# EAGLE design uv_exposure (EAGLE 7.2.0)
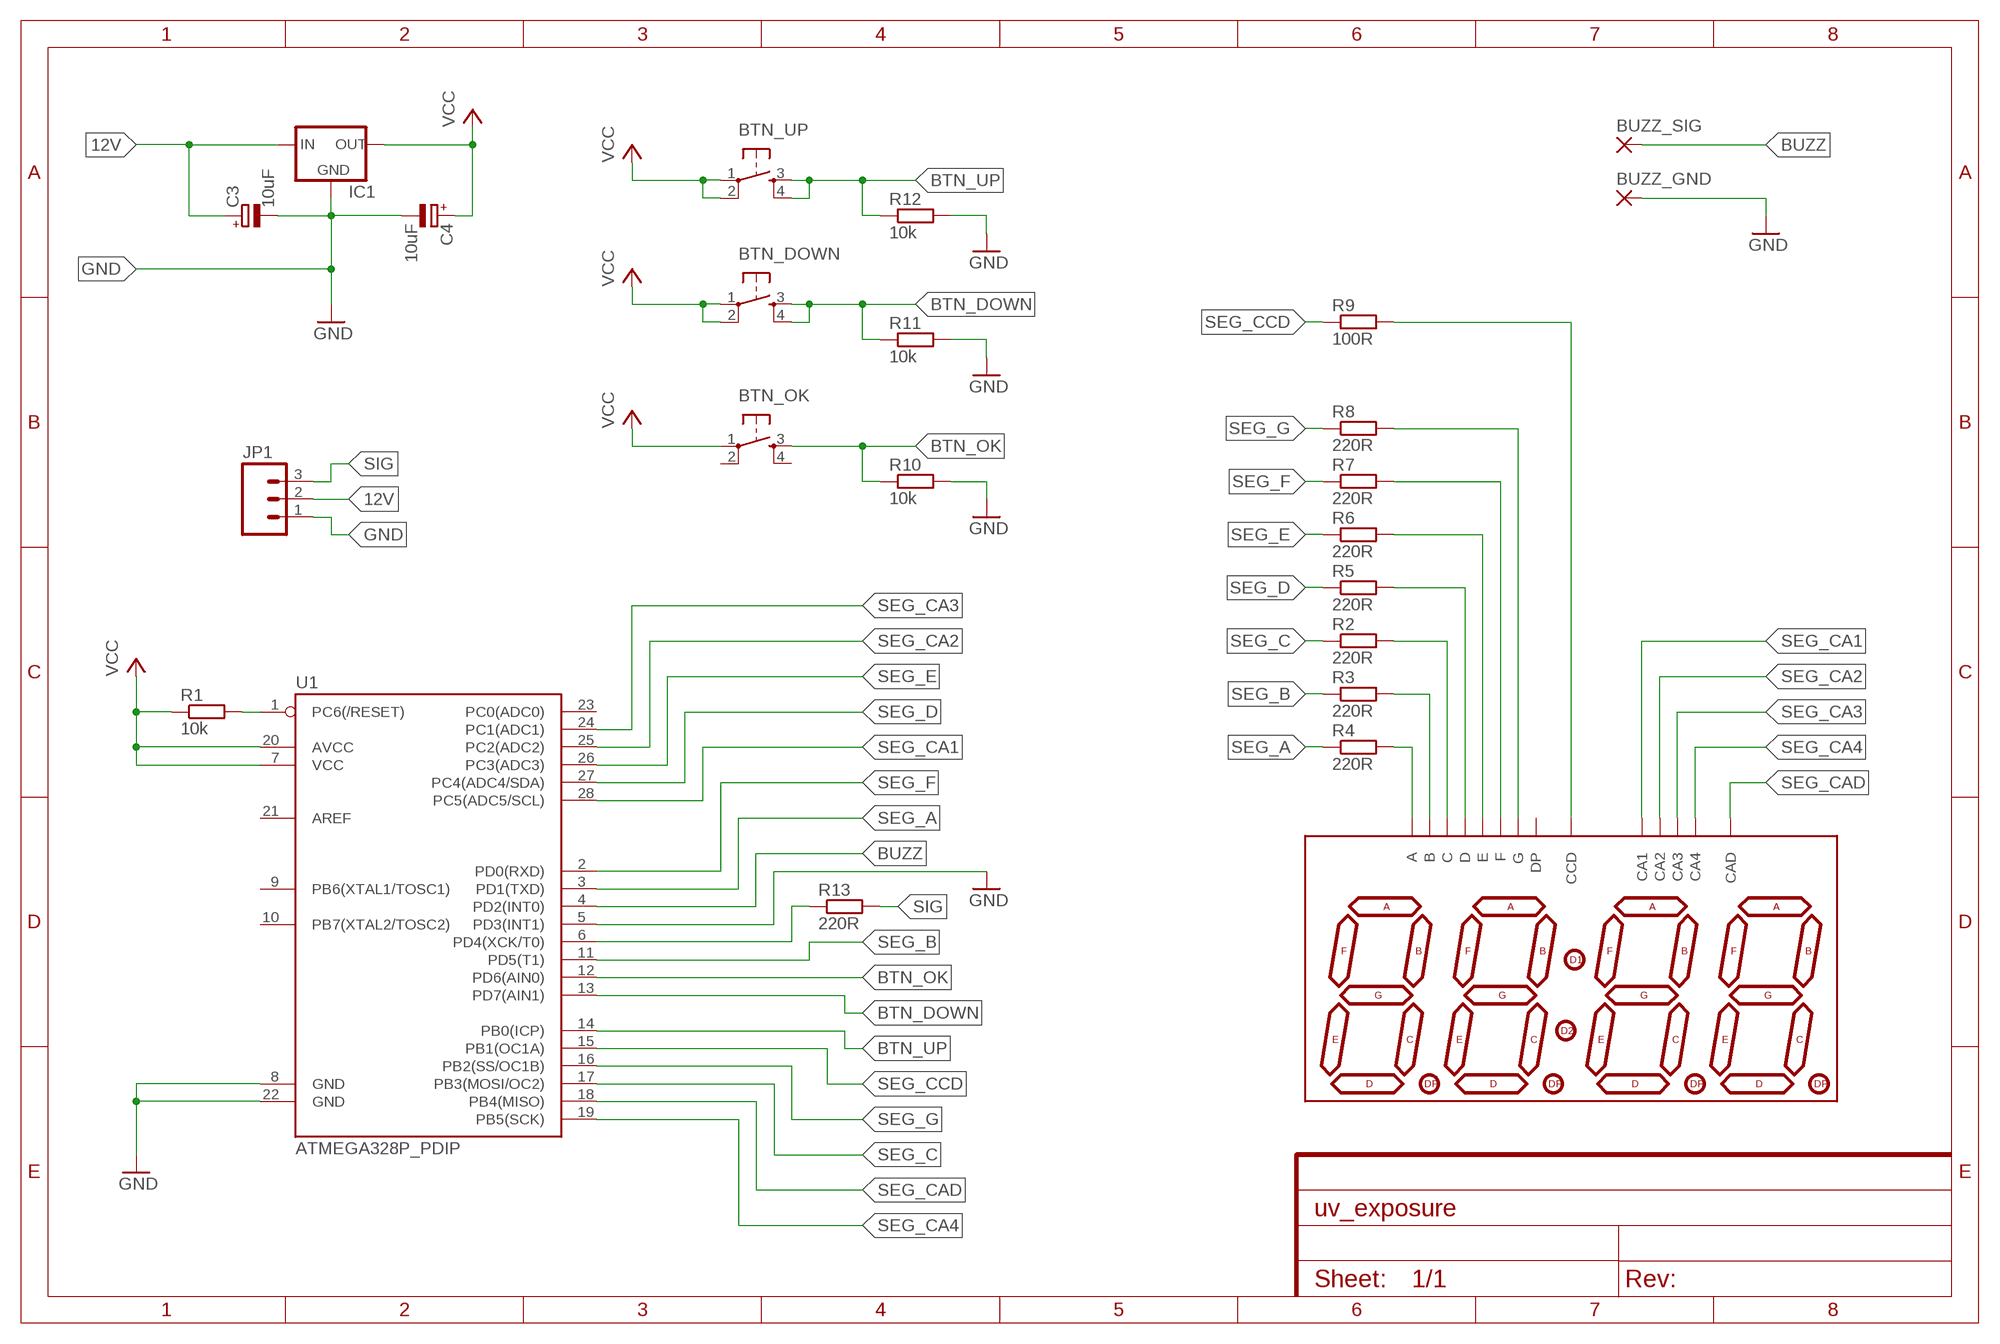
[diagram p0: schematic, sheet 1]
FRAME1 (FRAME-A4L): CNAME: Juraj Kostolansky; CREVISION: A; DESIGNER: www.kostolansky.sk

## Parts
BTN_DOWN  TAC_SWITCHPTH  [TACTILE-PTH]
BTN_OK  TAC_SWITCHPTH  [TACTILE-PTH]
BTN_UP  TAC_SWITCHPTH  [TACTILE-PTH]
BUZZ_GND  2,54/0,8  [2,54/0,8]
BUZZ_SIG  2,54/0,8  [2,54/0,8]
C3  10uF  CPOL-EUE2-5  [E2-5]
C4  10uF  CPOL-EUE2-5  [E2-5]
IC1  V_REG_78XXSINK  [TO220-IGO]
JP1  M03LOCK  [1X03_LOCK]
R1  10k  R-EU_0207/10  [0207/10]
R2  220R  R-EU_0207/10  [0207/10]
R3  220R  R-EU_0207/10  [0207/10]
R4  220R  R-EU_0207/10  [0207/10]
R5  220R  R-EU_0207/10  [0207/10]
R6  220R  R-EU_0207/10  [0207/10]
R7  220R  R-EU_0207/10  [0207/10]
R8  220R  R-EU_0207/10  [0207/10]
R9  100R  R-EU_0207/10  [0207/10]
R10  10k  R-EU_0207/10  [0207/10]
R11  10k  R-EU_0207/10  [0207/10]
R12  10k  R-EU_0207/10  [0207/10]
R13  220R  R-EU_0207/10  [0207/10]
U1  ATMEGA328P_PDIP  [DIL28-3]
U$1  5461BSDIP14  [5461BS]

## Nets
12V: C3.+ IC1.IN JP1.2
BTN_DOWN: BTN_DOWN.3 BTN_DOWN.4 R11.1 U1.13(PD7(AIN1))
BTN_OK: BTN_OK.3 R10.1 U1.12(PD6(AIN0))
BTN_UP: BTN_UP.3 BTN_UP.4 R12.1 U1.14(PB0(ICP))
BUZZ: BUZZ_SIG.1(P) U1.4(PD2(INT0))
GND: BUZZ_GND.1(P) C3.- C4.- IC1.GND JP1.1 R10.2 R11.2 R12.2 U1.5(PD3(INT1)) U1.8(GND) U1.22(GND)
N$1: R1.2 U1.1(PC6(/RESET))
N$4: R4.2 U$1.13(A)
N$5: R3.2 U$1.9(B)
N$6: R2.2 U$1.4(C)
N$7: R5.2 U$1.2(D)
N$8: R6.2 U$1.1(E)
N$9: R7.2 U$1.12(F)
N$10: R8.2 U$1.5(G)
N$11: R9.2 U$1.8(CCD)
N$12: R13.1 U1.6(PD4(XCK/T0))
SEG_A: R4.1 U1.3(PD1(TXD))
SEG_B: R3.1 U1.11(PD5(T1))
SEG_C: R2.1 U1.17(PB3(MOSI/OC2))
SEG_CA1: U1.28(PC5(ADC5/SCL)) U$1.14(CA1)
SEG_CA2: U1.25(PC2(ADC2)) U$1.11(CA2)
SEG_CA3: U1.24(PC1(ADC1)) U$1.10(CA3)
SEG_CA4: U1.19(PB5(SCK)) U$1.6(CA4)
SEG_CAD: U1.18(PB4(MISO)) U$1.7(CAD)
SEG_CCD: R9.1 U1.15(PB1(OC1A))
SEG_D: R5.1 U1.27(PC4(ADC4/SDA))
SEG_E: R6.1 U1.26(PC3(ADC3))
SEG_F: R7.1 U1.2(PD0(RXD))
SEG_G: R8.1 U1.16(PB2(SS/OC1B))
SIG: JP1.3 R13.2
VCC: BTN_DOWN.1 BTN_DOWN.2 BTN_OK.1 BTN_UP.1 BTN_UP.2 C4.+ IC1.OUT R1.1 U1.7(VCC) U1.20(AVCC)
Unconnected: BTN_OK.2 BTN_OK.4 U1.9(PB6(XTAL1/TOSC1)) U1.10(PB7(XTAL2/TOSC2)) U1.21(AREF) U1.23(PC0(ADC0)) U$1.3(DP)

## Library data of the parts
BTN_DOWN BTN_OK BTN_UP = SparkFun-Electromechanical:TAC_SWITCH: Momentary Switch Button commonly used for reset or general input. Spark Fun Electronics SKU : COM-00097 SMT- SWCH-08247
BUZZ_GND BUZZ_SIG = wirepad:2,54/0,8: THROUGH-HOLE PAD
C3 C4 = resistor:CPOL-EU: POLARIZED CAPACITOR, European symbol
IC1 = SparkFun-PowerIC:V_REG_78XX: Voltage Regulator Standard 7805 5V regulator. IGO (Input Ground Output). Spark Fun Electronics SKU : COM-00107
JP1 = SparkFun-Connectors:M03: Header 3 Standard 3-pin 0.1" header. Use with straight break away headers (SKU : PRT-00116), right angle break away headers (PRT-00553), swiss pins (PRT-00743), machine pins (PRT-00117), and female headers (PRT-00115). Molex polarized connector foot print use with SKU : PRT-08232 with associated crimp pins and housings.
R1-R13 = resistor:R-EU_: RESISTOR, European symbol
U1 = SparkFun-DigitalIC:ATMEGA328P_PDIP: uC used in the Arduino 32kb flash, 1k EEPROM, 2k SRAM This is the through-hole version of this chip.
U$1 = display:5461BS

## Board
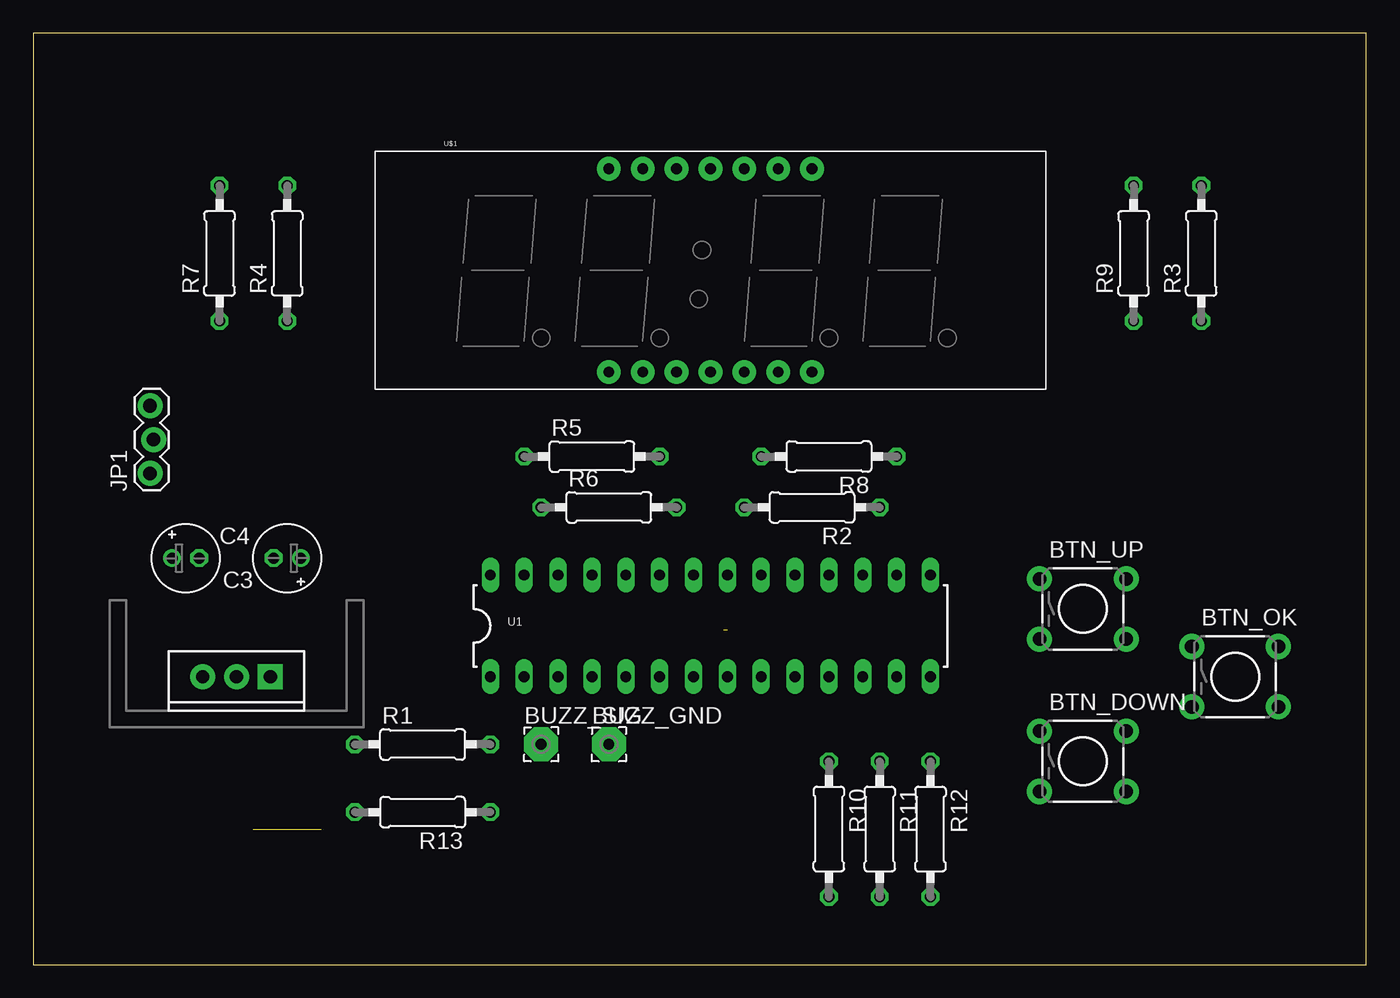
[diagram p1: board, top side]
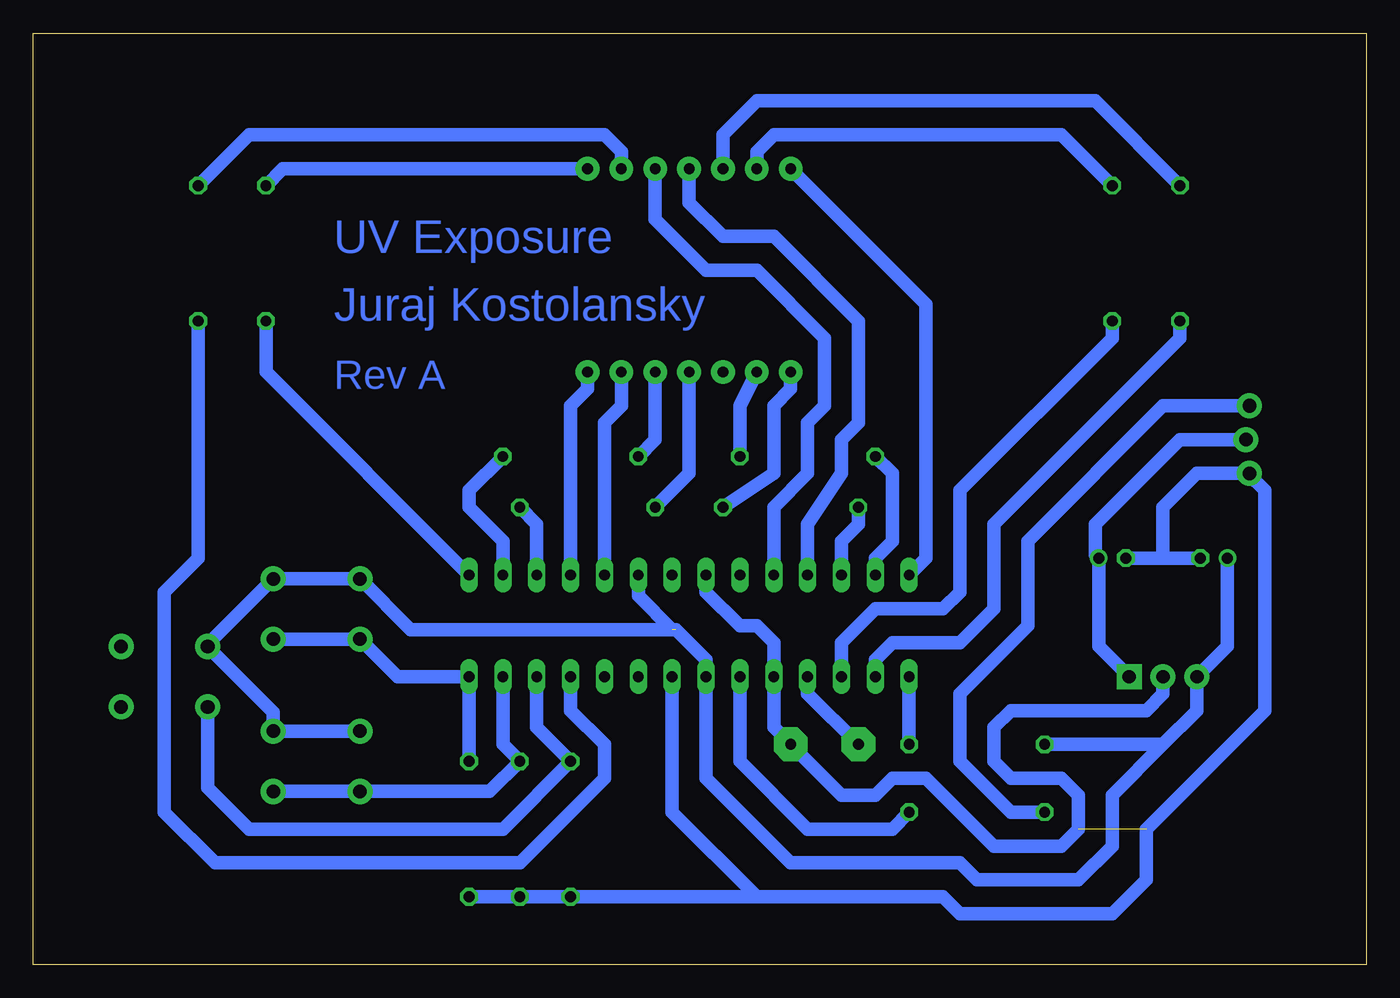
[diagram p2: board, bottom side, seen from below]

Size 100 x 69.84 mm. Coordinates in mm from the lower left corner, seen from the top.
Outline: 0,0 100,0 100,69.84 0,69.84 0,0
Copper layers (1*16): Top 0.035mm / dielectric 1.5mm / Bottom 0.035mm
Design rules "default": minimum track width 10mil, minimum drill 24mil, track to track 8mil, track to pad 8mil, pad to pad 8mil, via to via 8mil, smd to smd 8mil, copper to edge 40mil, drill to drill 8mil, minimum pad ring 10mil, minimum via ring 8mil, stop-mask expansion 4mil, vias tented up to drill 0mil, thermal gap 10mil

### Footprints (pad centres in the part's own frame; a part is rotated, then mirrored left to right if it is on the bottom)
TACTILE-PTH = drill 1.016 pad 1.88: 1 -3.251,2.261; 2 3.251,2.261; 3 -3.251,-2.261; 4 3.251,-2.261
2,54/0,8 = drill 0.813 pad 2.54 octagon: 1 0,0
E2-5 = drill 0.813 pad 1.27: + -1.016,0 | drill 0.813 pad 1.27 octagon: - 1.016,0
TO220-IGO = drill 1 pad 1.88: GND 0,0; OUT 2.54,0 | drill 1 pad 1.88 square: IN -2.54,0
1X03_LOCK = drill 1.016 pad 1.88: 1 0,0.127; 2 2.54,-0.127; 3 5.08,0.127
0207/10 = drill 0.813 octagon: 1 -5.08,0; 2 5.08,0
DIL28-3 = drill 0.813 long: 1 -16.51,-3.81; 2 -13.97,-3.81; 3 -11.43,-3.81; 4 -8.89,-3.81; 5 -6.35,-3.81; 6 -3.81,-3.81; 7 -1.27,-3.81; 8 1.27,-3.81; 9 3.81,-3.81; 10 6.35,-3.81; 11 8.89,-3.81; 12 11.43,-3.81; 13 13.97,-3.81; 14 16.51,-3.81; 15 16.51,3.81; 16 13.97,3.81; 17 11.43,3.81; 18 8.89,3.81; 19 6.35,3.81; 20 3.81,3.81; 21 1.27,3.81; 22 -1.27,3.81; 23 -3.81,3.81; 24 -6.35,3.81; 25 -8.89,3.81; 26 -11.43,3.81; 27 -13.97,3.81; 28 -16.51,3.81
5461BS = drill 0.8 pad 1.778: 1 -7.62,-7.62; 2 -5.08,-7.62; 3 -2.54,-7.62; 4 0,-7.62; 5 2.54,-7.62; 6 5.08,-7.62; 7 7.62,-7.62; 8 7.62,7.62; 9 5.08,7.62; 10 2.54,7.62; 11 0,7.62; 12 -2.54,7.62; 13 -5.08,7.62; 14 -7.62,7.62

### Placement (x,y rotation side)
BTN_DOWN  78.74,15.24 0 top
BTN_OK  90.17,21.59 0 top
BTN_UP  78.74,26.67 0 top
BUZZ_GND  43.18,16.51 0 top
BUZZ_SIG  38.1,16.51 0 top
C3  19.05,30.48 180 top
C4  11.43,30.48 0 top
IC1  15.24,21.59 180 top
JP1  8.89,36.83 90 top
R1  29.21,16.51 0 top
R2  58.42,34.29 180 top
R3  87.63,53.34 90 top
R4  19.05,53.34 90 top
R5  41.91,38.1 0 top
R6  43.18,34.29 0 top
R7  13.97,53.34 90 top
R8  59.69,38.1 180 top
R9  82.55,53.34 90 top
R10  59.69,10.16 270 top
R11  63.5,10.16 270 top
R12  67.31,10.16 270 top
R13  29.21,11.43 180 top
U1  50.8,25.4 0 top
U$1  50.8,52.07 0 top

### Tracks (layer width: path | path; a pad name or v marks a point on that pad's centre or on a via)
12V
  Bottom 1.016: JP1.2 13.97,39.37 20.32,33.02 20.32,30.73 C3.+ 20.07,23.88 IC1.IN
BTN_DOWN
  Bottom 1.016: BTN_DOWN.4 BTN_DOWN.3 65.76,12.98 R11.1 64.77,16.51 U1.13
BTN_OK
  Bottom 1.016: BTN_OK.3 86.92,13.26 83.82,10.16 64.77,10.16 R10.1 62.23,17.78 U1.12
BTN_UP
  Bottom 1.016: BTN_UP.4 BTN_UP.3 72.67,21.59 U1.14 R12.1
BUZZ
  Bottom 1.016: U1.4 41.91,20.32 BUZZ_SIG.1
GND  (1 unrouted)
  Bottom 1.016: C3.- 15.24,30.48 | 15.24,30.48 C4.- | 15.24,30.48 15.24,34.29 12.7,36.83 JP1.1 8.76,36.7 7.62,35.56 7.62,19.05 16.51,10.16 16.51,6.35 19.05,3.81 30.48,3.81 31.75,5.08 45.72,5.08 | R11.2 R12.2 R10.2 45.72,5.08 | U1.22 49.53,27.94 46.99,25.4 45.72,25.4 44.45,24.13 U1.5 44.45,17.78 BUZZ_GND.1 39.37,12.7 36.83,12.7 35.56,13.97 33.02,13.97 27.94,8.89 22.86,8.89 21.59,10.16 21.59,12.7 22.86,13.97 26.67,13.97 27.94,15.24 27.94,17.78 26.67,19.05 16.51,19.05 15.24,20.32 IC1.GND | 45.72,5.08 52.07,11.43 U1.8
N$1
  Bottom 1.016: U1.1 R1.2
N$4
  Bottom 1.016: R4.2 22.86,62.23 44.45,62.23 45.72,60.96 U$1.13
N$5
  Bottom 1.016: U$1.9 55.88,60.96 57.15,62.23 83.82,62.23 R3.2
N$6
  Bottom 1.016: U$1.4 50.8,36.83 R2.2
N$7
  Bottom 1.016: U$1.2 46.99,41.91 R5.2
N$8
  Bottom 1.016: R6.2 44.45,36.83 44.45,41.91 43.18,43.18 U$1.1
N$9
  Bottom 1.016: R7.2 20.32,64.77 45.72,64.77 48.26,62.23 U$1.12
N$10
  Bottom 1.016: U$1.5 53.34,39.37 R8.2
N$11
  Bottom 1.016: U$1.8 81.28,59.69 R9.2
N$12
  Bottom 1.016: R13.1 35.56,10.16 41.91,10.16 46.99,15.24 U1.6
SEG_A
  Bottom 1.016: R4.1 19.05,46.99 30.48,35.56 30.48,27.94 31.75,26.67 36.83,26.67 39.37,24.13 U1.3
SEG_B
  Bottom 1.016: R3.1 87.63,30.48 90.17,27.94 90.17,11.43 86.36,7.62 63.5,7.62 57.15,13.97 57.15,16.51 59.69,19.05 U1.11
SEG_C
  Bottom 1.016: R2.1 62.23,33.02 U1.17
SEG_CA1
  Bottom 1.016: U$1.14 33.02,49.53 33.02,30.48 U1.28
SEG_CA2
  Bottom 1.016: U$1.11 50.8,57.15 48.26,54.61 44.45,54.61 38.1,48.26 38.1,40.64 39.37,39.37 39.37,36.83 41.91,33.02 U1.25
SEG_CA3
  Bottom 1.016: U$1.10 53.34,55.88 49.53,52.07 45.72,52.07 40.64,46.99 40.64,41.91 41.91,40.64 41.91,36.83 44.45,34.29 U1.24
SEG_CA4
  Bottom 1.016: U$1.6 55.88,41.91 57.15,40.64 U1.19
SEG_CAD
  Bottom 1.016: U$1.7 58.42,43.18 59.69,41.91 U1.18
SEG_CCD
  Bottom 1.016: R9.1 82.55,44.45 U1.15
SEG_D
  Bottom 1.016: U1.27 36.83,30.48 35.56,31.75 35.56,36.83 R5.1
SEG_E
  Bottom 1.016: R6.1 38.1,33.02 39.37,31.75 U1.26
SEG_F
  Bottom 1.016: R7.1 13.97,46.99 27.94,33.02 27.94,26.67 30.48,24.13 35.56,24.13 36.83,22.86 U1.2
SEG_G
  Bottom 1.016: R8.1 67.31,35.56 67.31,34.29 64.77,31.75 U1.16
SIG
  Bottom 1.016: JP1.3 15.24,41.91 25.4,31.75 25.4,25.4 30.48,20.32 30.48,15.24 26.67,11.43 R13.2
VCC  (1 unrouted)
  Bottom 1.016: C4.+ 10.41,23.88 IC1.OUT 12.7,19.05 15.24,16.51 | 51.79,25.12 49.53,22.86 U1.7 49.53,13.97 43.18,7.62 30.48,7.62 29.21,6.35 21.59,6.35 19.05,8.89 19.05,12.7 15.24,16.51 | U1.20 54.61,27.66 52.07,25.12 71.68,25.12 BTN_UP.1 BTN_UP.2 86.92,24 BTN_OK.1 81.99,18.92 BTN_DOWN.2 BTN_DOWN.1 | R1.1 15.24,16.51

### Text on the board
Bottom: UV Exposure | Juraj Kostolansky | Rev A